# Altium project TSAL.PrjPcb
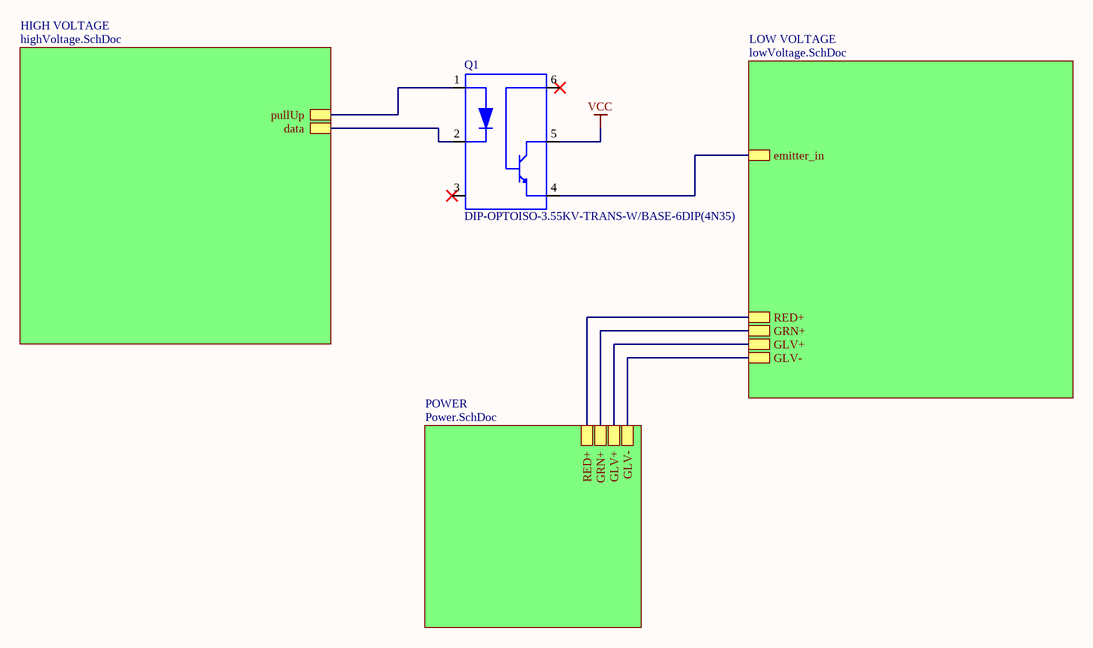
[diagram p0: TOP.SchDoc]
4 sheets, 36 parts. Net scope: hierarchical (ports join the sheet entries above them; power ports are global).
Board file: PCB.PcbDoc
Sheets:
  TOP.SchDoc
    HIGH VOLTAGE = highVoltage.SchDoc
    POWER = Power.SchDoc
    LOW VOLTAGE = lowVoltage.SchDoc

## Sheet TOP.SchDoc: =DocumentName
size A4; Organization: Queen's Formula SAE; Address1: 130 Stuart St, Kingston; Address2: Ontario; Address3: Canada; Address4: K7L 2V9; DocumentNumber: 1; Revision: 0; SheetNumber: 1; SheetTotal: 1

### Parts
Q1  DIP-OPTOISO-3.55KV-TRANS-W/BASE-6DIP(4N35)  [DIP6-2.54-7.3X6.5MM]

### Sub-sheets
HIGH VOLTAGE = highVoltage.SchDoc: pullUp, data
LOW VOLTAGE = lowVoltage.SchDoc: GLV-, GLV+, GRN+, RED+, emitter_in
POWER = Power.SchDoc: GLV-, GLV+, GRN+, RED+

### Nets
VCC: Q1.5(COLLECTOR)  [project net regulatorIn]
negativeRegulatorIn: Q1.4(EMITER) ; sheet POWER/GLV-, sheet LOW VOLTAGE/GLV-, sheet LOW VOLTAGE/emitter_in
NetD1_1: sheet POWER/GLV+, sheet LOW VOLTAGE/GLV+
NetD2_2: sheet POWER/RED+, sheet LOW VOLTAGE/RED+
NetJ1_2: sheet POWER/GRN+, sheet LOW VOLTAGE/GRN+
NetQ1_1: Q1.1(ANODE) ; sheet HIGH VOLTAGE/pullUp
NetQ1_2: Q1.2(CATHODE) ; sheet HIGH VOLTAGE/data

Not connected (* = marked no-connect by the designer): Q1 3(NC)* 6(BASE)*

### Notes on the sheet
- Title
- Size:
- Date:
- A4
- Number:
- Time:
- Revision:
- Sheet
- of
- File:

### Library data of the parts
Q1 = DIP-OPTOISO-3.55KV-TRANS-W/BASE-6DIP(4N35): Optoisolator Transistor with Base Output 5000Vrms 1 Channel 6-DIP; MF: Vishay; Purchase-URL: https://pricing.snapeda.com/search/part/4N35/?ref=eda; Price: None; SnapEDA_Link: https://www.snapeda.com/parts/4N35/Vishay%20Semiconductor%20Opto%20Division/view-part/579099/?ref=snap; MP: 4N35; Availability: Good; Value: *; Check_prices: https://www.snapeda.com/parts/4N35/Vishay%20Semiconductor%20Opto%20Division/view-part/579099/?ref=eda; Package: DIP-6 Texas Instruments

## Sheet highVoltage.SchDoc
size A4
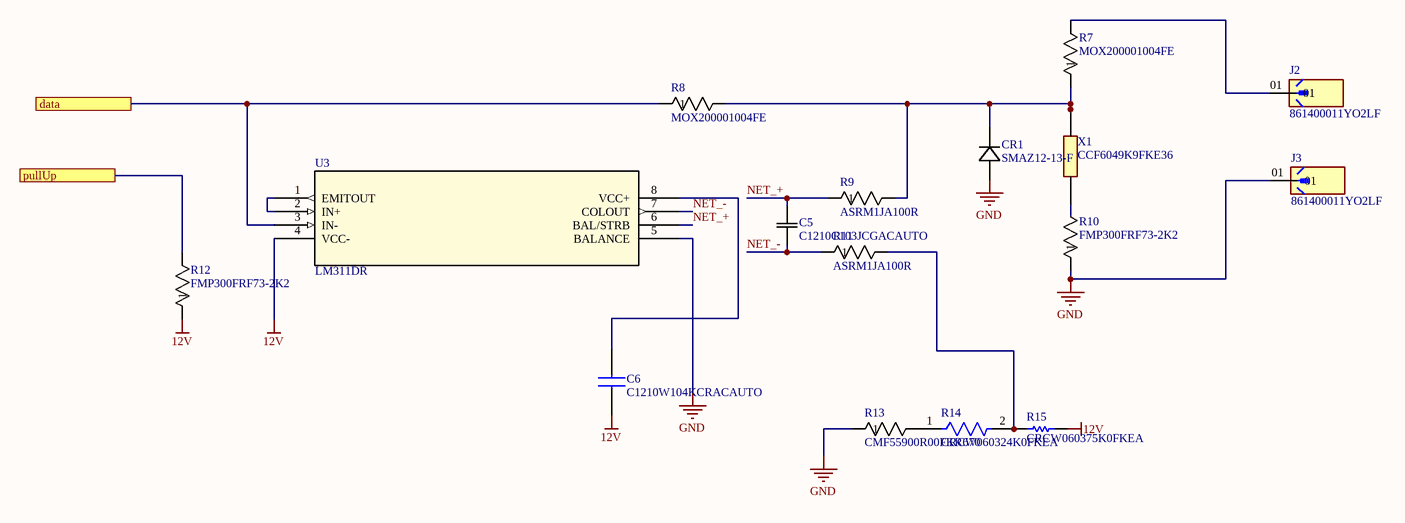
[diagram p1: highVoltage.SchDoc]

### Parts
C5  C1210C103JCGACAUTO  [CAPC340270_140N_KEM]
C6  C1210W104KCRACAUTO  [CAPC3225X230N]
CR1  SMAZ12-13-F  [SMA_DIO]
J2  861400011YO2LF  [AMPHENOL_861400011YO2LF]
J3  861400011YO2LF  [AMPHENOL_861400011YO2LF]
R7  MOX200001004FE  [RES_MOX-200_OHM]
R8  MOX200001004FE  [RES_MOX-200_OHM]
R9  ASRM1JA100R  [RES_ASRM1_STP]
R10  FMP300FRF73-2K2  [RES_FMP300_15P5X5_YAG]
R11  ASRM1JA100R  [RES_ASRM1_STP]
R12  FMP300FRF73-2K2  [RES_FMP300_15P5X5_YAG]
R13  CMF55900R00FKR670  [RES_CMF07_VIS]
R14  CRCW060324K0FKEA  [FP-CRCW0603-e3-IPC_C]
R15  CRCW060375K0FKEA  [RESC1609X50X30NL10T20]
U3  LM311DR  [D8]
X1  CCF6049K9FKE36  [RESAD2428W69L1016D353]

### Ports
data, pullUp

### Nets
12V: C6.1 R12.1 R15.2 U3.4(VCC-)
GND: J3.01 R10.1 R13.1 U3.5(BALANCE)
NET_+: C5.2 R9.1 U3.6(BAL/STRB)
NET_-: C5.1 R11.1 U3.7(COLOUT)
NetC6_2: C6.2 U3.8(VCC+)
NetCR1_1: CR1.1 R7.1 R8.2 R9.2 X1.2
NetJ2_01: J2.01 R7.2
NetQ1_1: R12.2 ; port pullUp
NetQ1_2: R8.1 U3.3(IN-) ; port data
NetR10_2: R10.2 X1.1
NetR11_2: R11.2 R14.2 R15.1
NetR13_2: R13.2 R14.1
NetU3_1: U3.1(EMITOUT) U3.2(IN+)

Not connected (* = marked no-connect by the designer): CR1 2

### Notes on the sheet
- Labels drawn without touching a wire or pin: GND

### Library data of the parts
C5 = C1210C103JCGACAUTO: No Description Available; Mfr_Name: Kemet; Type: DEV; Copyright: Copyright (C) 2024 Ultra Librarian. All rights reserved.; Manufacturer_Part_Number: C1210C103JCGACAUTO; RefDes: RefDes
C6 = C1210W104KCRACAUTO: ArcShield SMD Auto X7R HV, Ceramic, 0.1 uF, 10%, 500 VDC, 750 VDC, 125C, -55C, X7R, SMD, MLCC, ArcShield, High Voltage, Automotive Grade, 2.5 % , 1 GOhms, 105 mg, 1210, 3.3mm, 2.6mm, 2.1mm, 0.6mm, 2000, 78  Weeks, 80; Manufacturer_Name: KEMET; Geometry.Height: 2.3mm; Manufacturer_Part_Number: C1210W104KCRACAUTO; Mouser Part Number: 80-C1210W104KCRAUTO; Mouser Price/Stock: https://www.mouser.co.uk/ProductDetail/KEMET/C1210W104KCRACAUTO?qs=dO8Bi0p7p7Q4YyAQZJXbEw%3D%3D; Arrow Part Number: *; Arrow Price/Stock: *; Datasheet Link: https://content.kemet.com/datasheets/KEM_C1034_X7R_HV_ARC_SMD.pdf
CR1 = SMAZ12-13-F: No Description Available; Mfr_Name: Diodes Inc; Type: DEV; Copyright: Copyright (C) 2024 Ultra Librarian. All rights reserved.; Manufacturer_Part_Number: SMAZ12-13-F; RefDes: RefDes
J2 J3 = 861400011YO2LF: Board to Board connector, Unshrouded Header, Through Hole, Single Row, 1 Position, Vertical.; MF: AMPHENOL ICC / FCI; Purchase-URL: https://pricing.snapeda.com/search/part/861400011YO2LF/?ref=eda; Package: None; MP: 861400011YO2LF; Value: *; Digi-Key_Part_Number: 609-861400011YO2LF-ND; Check_prices: https://www.snapeda.com/parts/861400011YO2LF/Amphenol/view-part/?ref=eda; SnapEDA_Link: https://www.snapeda.com/parts/861400011YO2LF/Amphenol/view-part/?ref=snap
R7 R8 = MOX200001004FE: No Description Available; Mfr_Name: Ohmite; Copyright: Copyright (C) 2024 Ultra Librarian. All rights reserved.; Manufacturer_Part_Number: MOX200001004FE; Digi-Key_Part_Number_1: MOX200001004FE-ND; RefDes: RefDes; Type: DEV
R9 R11 = ASRM1JA100R: No Description Available; Mfr_Name: Stackpole International; Copyright: Copyright (C) 2024 Ultra Librarian. All rights reserved.; Manufacturer_Part_Number: ASRM1JA100R; RefDes: RefDes; Type: DEV
R10 R12 = FMP300FRF73-2K2: No Description Available; Mfr_Name: Yageo; Copyright: Copyright (C) 2024 Ultra Librarian. All rights reserved.; Manufacturer_Part_Number: FMP300FRF73-2K2; RefDes: RefDes; Type: DEV
R13 = CMF55900R00FKR670: No Description Available; Mfr_Name: Vishay; Copyright: Copyright (C) 2024 Ultra Librarian. All rights reserved.; Manufacturer_Part_Number: CMF55900R00FKR670; RefDes: RefDes; Type: DEV
R14 = CMP-1012-00664-3: RES Thick Film, 24kΩ, 1%, 0.1W, 100ppm/°C, 0603; Working Voltage: 75V; Resistance: 24kR; Max Power Dissipation: 100mW; Mount: Surface Mount; Depth: 0.85mm; Length: 1.55mm; Military Standard: Not; Package Quantity: 10; Tolerance: 1%; Lead Free: Lead Free; Termination: SMD/SMT; Radiation Hardening: No; Contact Plating: Tin; Temperature Coefficient: 100ppm/°C; Number of Terminations: 2; Packaging: Tape and Reel; Voltage Rating: 75V; Min Operating Temperature: -55°C; Voltage Rating (DC): 75V; Composition: Thick Film; Weight: 7.1E-05oz; Max Operating Temperature: 155°C; Case Code (Metric): 1608; Width: 0.033inch; Power Rating: 100mW; Case/Package: 0603; Height: 0.45mm; Features: Automotive AEC-Q200; Case Code (Imperial): 0603
R15 = CMP-2000-03571-1: Manufacturer: Vishay Dale; Part Number: CRCW060375K0FKEA
U3 = LM311DR: No Description Available; Mfr_Name: Texas Instruments; Copyright: Copyright (C) 2024 Ultra Librarian. All rights reserved.; Manufacturer_Part_Number: LM311DR; RefDes: RefDes; Type: DEV
X1 = CCF6049K9FKE36: Metal Film Resistors - Through Hole 1/2watt 49.9Kohms 1% Rated to 1watt; Manufacturer_Name: Vishay; Manufacturer_Part_Number: CCF6049K9FKE36; Mouser Part Number: *; Mouser Price/Stock: *; Arrow Part Number: CCF6049K9FKE36; Arrow Price/Stock: https://www.arrow.com/en/products/ccf6049k9fke36/vishay?region=nac; Datasheet Link: https://www.vishay.com/doc?31068

## Sheet Power.SchDoc
size A4
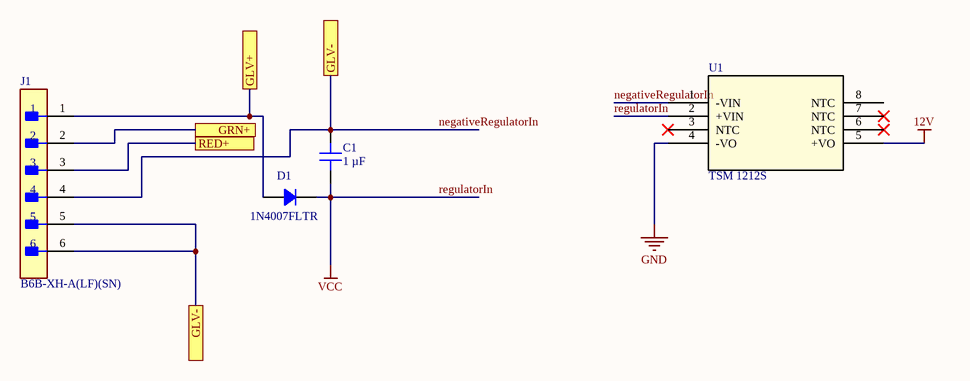
[diagram p2: Power.SchDoc]

### Parts
C1  1 µF  [CAP 0805_2012]
D1  1N4007FLTR  [SOD123F]
J1  B6B-XH-A(LF)(SN)  [FP-B6B-XH-A_LF_SN-MFG]
U1  TSM 1212S  [TSM_SINGLE_TRP]

### Ports
GLV+, GLV-, GRN+, RED+

### Nets
12V: U1.5(+VO)
GND: U1.4(-VO)
regulatorIn: C1.1 D1.2 U1.2(+VIN)  [also labelled VCC]
negativeRegulatorIn: C1.2 J1.4 J1.5 J1.6 U1.1(-VIN) ; port GLV-
NetD1_1: D1.1 J1.1 ; port GLV+
NetD2_2: J1.3 ; port RED+
NetJ1_2: J1.2 ; port GRN+

Not connected (* = marked no-connect by the designer): U1 3(NTC)* 6(NTC)* 7(NTC)* 8(NTC)

### Library data of the parts
C1 = GCJ21BR71H105KA01L: CAP CER 1UF 50V X7R 0805; manufacturer: Murata Electronics; Tolerance: ±10%; Part Number: GCJ21BR71H105KA01L; Value: 1 µF; Applications: Automotive, Boardflex Sensitive; Capacitance: 1 µF; componentlink1description: Datasheet; componentlink1url: https://www.murata.com/~/media/webrenewal/support/library/catalog/products/capacitor/mlcc/c03e.ashx?la=en-us; componentlink2description: DigiKey Link; componentlink2url: https://www.digikey.com/en/products/detail/murata-electronics/GCJ21BR71H105KA01L/4903512; Device Package: 0805 (2012 Metric); Features: Soft Termination; lastupdated: 2023-12-23 8:15:46 PM; Lifecycle Status: Active; Minimum Order: 1; Mounting Type: Surface Mount, MLCC; Operating Temperature: -55°C ~ 125°C; Package / Case: 0805 (2012 Metric); packaging: TapeAndReel; partid: 2709; Part Status: Active; price: 0.05; Ratings: AEC-Q200; series: GCJ; Size / Dimension: 0.079" L x 0.049" W (2.00mm x 1.25mm); Supplier 1: DigiKey; Supplier Part Number 1: 490-10667-1-ND; Temperature Coefficient: X7R; Thickness (Max): 0.057" (1.45mm); Voltage - Rated: 50V
D1 = 1N4007FLTR: STANDARD RECTIFIER 1000V SOD-123; Manufacturer: SMC Diode Solutions; Capacitance @ Vr, F: 15pF @ 4V, 1MHz; Current - Average Rectified (Io): 1A; Current - Reverse Leakage @ Vr: 5µA @ 1000V; Speed: Standard Recovery >500ns, > 200mA (Io); Voltage - Forward (Vf) (Max) @ If: 1.1V @ 1A; Part Number: 1N4007FLTR; ComponentLink1Description: Datasheet; ComponentLink1URL: http://www.smc-diodes.com/propdf/1N4001FL-1N4007FL%20N1646%20REV.A.pdf; ComponentLink2Description: DigiKey Link; ComponentLink2URL: http://digikey.com/product-detail/en/smc-diode-solutions/1N4007FLTR/1655-1N4007FLCT-ND/11657827; Diode Type: Standard; LastUpdated: 2020-08-30 8:59:55 PM; Lifecycle Status: Active; Minimum Order: 1; Mounting Type: Surface Mount; Package / Case: SOD-123F; Packaging: TapeAndReel; PartId: 3314; Price: 0.01; Supplier 1: DigiKey; Supplier Part Number 1: 1655-1N4007FLCT-ND; Supplier Device Package: SOD-123FL; Voltage - DC Reverse (Vr) (Max): 1000V
J1 = CMP-17439-000076-1: CONN HEADER VERT 6POS 2.5MM
U1 = TSM 1212S: No Description Available; Mfr_Name: Traco Power; Copyright: Copyright (C) 2024 Ultra Librarian. All rights reserved.; Manufacturer_Part_Number: TSM 1212S; RefDes: RefDes; Type: DEV

## Sheet lowVoltage.SchDoc
size A4
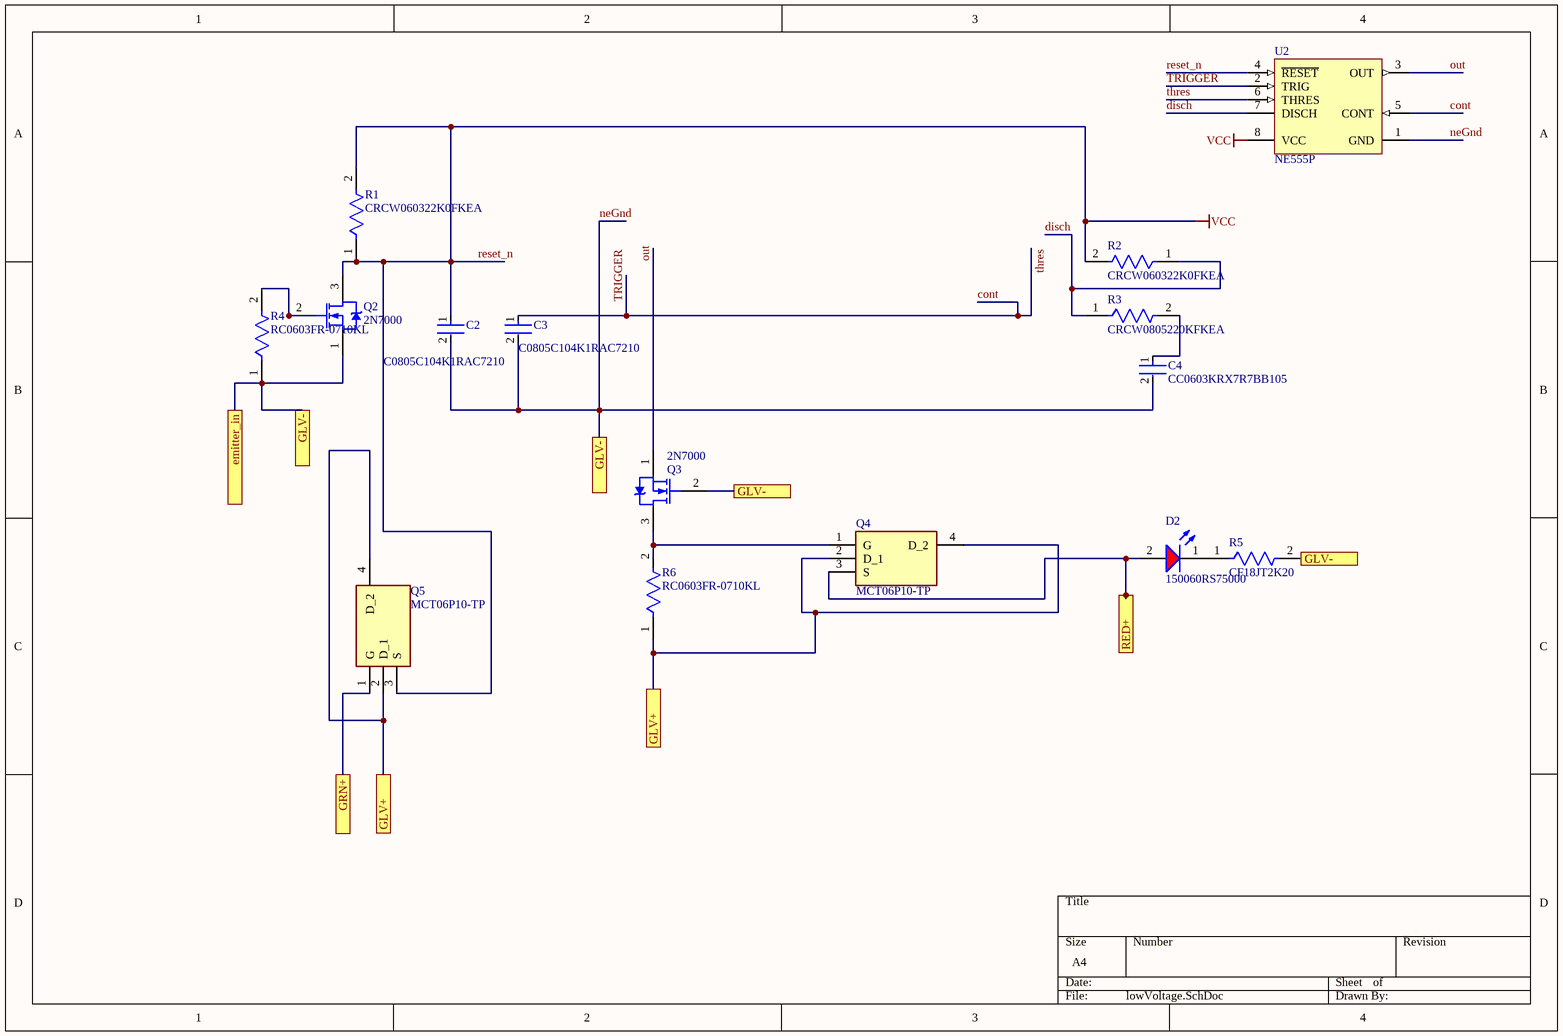
[diagram p3: lowVoltage.SchDoc]

### Parts
C2  C0805C104K1RAC7210  [FP-C0805C-DN-MFG]
C3  C0805C104K1RAC7210  [FP-C0805C-DN-MFG]
C4  CC0603KRX7R7BB105  [FP-CC0603-DA-MFG]
D2  150060RS75000  [WL-SMCW_0603_150060xx75000]
Q2  2N7000  [ONSC-TO-92-3-29-11]
Q3  2N7000  [ONSC-TO-92-3-29-11]
Q4  MCT06P10-TP  [SOT230P700X180-4N]
Q5  MCT06P10-TP  [SOT230P700X180-4N]
R1  CRCW060322K0FKEA  [FP-CRCW0603-e3-IPC_B]
R2  CRCW060322K0FKEA  [FP-CRCW0603-e3-IPC_B]
R3  CRCW0805220KFKEA  [FP-CRCW0805-e3-IPC_C]
R4  RC0603FR-0710KL  [FP-RC0603-0_55-IPC_C]
R5  CF18JT2K20  [FP-CF18-MFG]
R6  RC0603FR-0710KL  [FP-RC0603-0_55-IPC_C]
U2  NE555P  [P0008A]

### Ports
emitter_in, GLV+, GLV-, GRN+, RED+

### Nets
reset_n: C2.1 Q2.3(D) Q5.3(S) R1.1 R1.2 R2.2 U2.4(~{RESET}) U2.8(VCC)  [also labelled VCC]  [project net regulatorIn]
cont: C3.1 U2.2(TRIG) U2.5(CONT) U2.6(THRES)  [also labelled thres, TRIGGER]
disch: R2.1 R3.1 U2.7(DISCH)
neGnd: C2.2 C3.2 C4.2 Q2.1(S) Q3.2(G) R4.1 R5.2 U2.1(GND) ; port GLV-, port emitter_in  [project net negativeRegulatorIn]
out: Q3.1(S) U2.3(OUT)
NetC4_1: C4.1 R3.2
NetD1_1: Q4.2(D_1) Q4.4(D_2) Q5.2(D_1) Q5.4(D_2) R6.1 ; port GLV+
NetD2_1: D2.1(K) R5.1
NetD2_2: D2.2(A) Q4.3(S) ; port RED+
NetJ1_2: Q5.1(G) ; port GRN+
NetQ2_2: Q2.2(G) R4.2
NetQ3_3: Q3.3(D) Q4.1(G) R6.2

### Library data of the parts
C2 C3 = CMP-03020-008988-2: C0805 0.10 μF X7R 30ppm/°C 10.00% 100 V; Manufacturer: KEMET; Tolerance: 0.1; Value: 0.10 μF; Material: Ceramic; Voltage Rating: 100 V; Capacitance: 0.10 μF; RoHS: TRUE; Manufacturer Part Number: C0805C104K1RAC7210; ComponentLink2Description: Datasheet; Automotive: No; Device Class L3: Ceramic Capacitors; Category: Cap; Octopart: https://octopart.com/c0805c104k1rac7210-kemet-24791099; Temperature Range Low: -55°C; Lead Free: Yes; Device Class L2: Capacitors; ComponentLink2URL: https://content.kemet.com/datasheets/KEM_C1003_C0G_SMD.pdf; Temperature: -55°C to +125°C; Package: C0805C-DN; Temperature Range High: +125°C; Temperature Coefficient: 30ppm/°C; Ipc Land Pattern Name: CAPC200125X78; Height: 0.88mm; Device Class L1: Passive Components; Temperature Characteristic: X7R
C4 = CMP-03422-000924-1: CAP CER 1UF 16V X7R 0603; Manufacturer: YAGEO; Tolerance: 0.1; Description: CC0603 1 uF X7R 10.00% 16 V; Temperature Coefficient: 15%; Material: Ceramic; Package: CC0603-DA; RoHS: TRUE; Device Class L2: Capacitors; Temperature Characteristic: X7R; Temperature: -55°C to +125°C; Temperature Range Low: -55°C; Automotive: No; ComponentLink2Description: Datasheet; Value: 1 uF; Lead Free: Yes; Capacitance: 1 uF; ComponentLink2URL: http://www.yageo.com/documents/recent/UPY-GPHC_X7R_6.3V-to-50V_18.pdf; Device Class L1: Passive Components; Voltage: 16 V; Octopart: https://octopart.com/cc0603krx7r7bb105-yageo-42271928; Category: Cap; Digikey Description: CAP CER 1UF 16V X7R 0603; Footprint Url: http://www.yageo.com/exep/pages/download/literatures/UPY-C_GEN_24.pdf; Height: 0.9mm; Manufacturer Part Number: CC0603KRX7R7BB105; Voltage Rating: 16 V; Temperature Range High: +125°C; Mouser Description: Multilayer Ceramic Capacitor, CC Series, 1 - F, - 10%, X7R, 16 V, 0603 [1608 Metric]; Device Class L3: Ceramic Capacitors
D2 = CMP-1426-00001-3: NexarPartId: 29717776; Color: Red; Power Dissipation: 72mW; Max Reverse Voltage (DC): 5V; Peak Wavelength: 630nm; Viewing Angle: 140°; Forward Voltage: 2V; Luminous Intensity: 250mcd; Forward Current: 100mA; Dominant Wavelength: 625nm; Lens Style: Clear, Rectangular; Max Junction Temperature (Tj): 95°C; Test Current: 20mA; Mount: Surface Mount; Packaging: Tape and Reel; Case Code (Metric): 1608; Max Operating Temperature: 85°C; Case Code (Imperial): 0603; REACH SVHC: Unknown; Width: 800µm; Length: 1.6mm; Reverse Voltage: 5V; Height: 700µm; Case/Package: 0603; RoHS: Compliant; Wavelength: 625nm; Min Operating Temperature: -40°C
Q2 Q3 = CMP-1058-00936-1: Small Signal MOSFET, 200 mA, 60 V, N-Channel, 3-Pin TO-92, Bulk Box; Manufacturer: On Semiconductor; Ciss Typ (pF): 60; VGS(th) Max (V): 3; Crss Typ (pF): 5; Channel Polarity: N Channel; VGS Max (V): 20; Configuration: Single; PD Max (W): 0.35; Coss Typ (pF): 25; ID Max (A): 0.2; PackageVersion: Rev. AM; ComponentLink3URL: http://www.onsemi.cn/pub_link/Collateral/2N6426-D.PDF; ComponentLink2URL: http://www.onsemi.com/pub_link/Collateral/2N7000-D.PDF; DatasheetVersion: Rev. 8; Mounting Technology: Through Hole; V(BR)DSS Min (V): 60; PartNumber: 2N7000; PackageDescription: 3-Pin Transistor Outline, Body 4.825 x 3.685 mm, Pitch 1.27 mm; ComponentLink2Description: Datasheet; ComponentLink1URL: http://www.onsemi.com/; PackageReference: TO-92-3-29-11_AM_SL; Packing: Bulk Box; ComponentLink1Description: Manufacturer URL; Package Type: TO-92; ComponentLink3Description: Package Specification
Q4 Q5 = MCT06P10-TP: P-CHANNEL MOSFET; Manufacturer_Name: MCC; Geometry.Height: 1.8mm; Manufacturer_Part_Number: MCT06P10-TP; Mouser Part Number: 833-MCT06P10-TP; Mouser Price/Stock: https://www.mouser.co.uk/ProductDetail/Micro-Commercial-Components-MCC/MCT06P10-TP?qs=u16ybLDytRb58JP1wVwnug%3D%3D; Arrow Part Number: MCT06P10-TP; Arrow Price/Stock: https://www.arrow.com/en/products/mct06p10-tp/micro-commercial-components; Datasheet Link: https://www.mccsemi.com/pdf/Products/MCT06P10(SOT-223).pdf
R1 R2 = CMP-2000-03092-2: RES Thick Film, 22kΩ, 1%, 0.1W, 100ppm/°C, 0603; Voltage Rating: 75V; Max Power Dissipation: 100mW; Resistance: 22kR; Radiation Hardening: No; Termination: SMD/SMT; Composition: Thick Film; Tolerance: 1%; Temperature Coefficient: 100ppm/°C; Case Code (Imperial): 0603; Height: 0.45mm; Packaging: Tape and Reel; Power Rating: 100mW; Case/Package: 0603; Number of Terminations: 2; Package Quantity: 10; Weight: 7.1E-05oz; Voltage Rating (DC): 75V; Max Operating Temperature: 155°C; Contact Plating: Tin; Width: 0.85mm; Case Code (Metric): 1608; Mount: Surface Mount; Min Operating Temperature: -55°C; Depth: 0.85mm; Features: Automotive AEC-Q200; Military Standard: Not; Lead Free: Lead Free; Length: 1.55mm
R3 = CMP-1013-00772-3: RES Thick Film, 220kΩ, 1%, 0.125W, 100ppm/°C, 0805; Max Power Dissipation: 125mW; Resistance: 220kR; Voltage Rating: 150V; Max Operating Temperature: 155°C; Min Operating Temperature: -55°C; Termination: SMD/SMT; Temperature Coefficient: 100ppm/°C; Radiation Hardening: No; Number of Terminations: 2; Length: 2mm; Weight: 0.000194oz; Packaging: Tape and Reel; Case Code (Imperial): 0805; Case/Package: 0805; Military Standard: Not; Package Quantity: 10; Contact Plating: Tin; Power Rating: 125mW; Tolerance: 1%; Lead Free: Lead Free; Height: 0.45mm; Width: 1.25mm; Composition: Thick Film; Voltage Rating (DC): 150V; Features: Automotive AEC-Q200; Case Code (Metric): 2012; Depth: 1.25mm
R4 R6 = CMP-2100-03664-2: RES 10K OHM 1% 1/10W 0603; Voltage Rating: 75V; Voltage Rating (DC): 50V; Resistance: 10kR; Power Rating: 100mW; Temperature Coefficient: 100ppm/°C; Depth: 0.8mm; Termination: SMD/SMT; Resistor Type: Thick Film; Series: RC; Construction: Rectangular; Features: Moisture Resistant; Packaging: Tape and Reel; Min Operating Temperature: -55°C; Number of Terminations: 2; Lead Pitch: 0.3mm; RoHS Compliant: Yes; Case/Package: 0603; Resistance Tolerance: 1%; Military Standard: Not; Weight: 7.1E-05oz; Number of Pins: 2; Tolerance: 1%; Length: 1.6mm; Case Code (Imperial): 0603; Lead Free: Lead Free; Width: 0.8mm; Max Power Dissipation: 100mW; Height: 0.45mm; Max Operating Temperature: 155°C; Case Code (Metric): 1608; Size Code: 0603
R5 = CMP-26528-000001-1: RES 2.2K OHM 1/8W 5% CF AXIAL; Manufacturer: Stackpole Electronics Inc; Value: 2.2kΩ; Voltage Rating: 250V; Temperature Coefficient: 0/-400ppm/°C; Power Rating: 0.125W; Composition: Carbon Film; Octopart: https://octopart.com/cf18jt2k20-stackpole+electronics-19205714; Tolerance: 5%; Series: CF; Temperature Range Low: -55°C; ComponentLink2URL: https://www.seielect.com/catalog/sei-cf_cfm.pdf; Ipc Land Pattern Name: RESAD656W65L360D200; Package: CF18; Device Class L2: Resistors; Device Class L3: Through-Hole Resistors; Resistance: 2.2kΩ; Height: 2mm; Category: Res; ComponentLink2Description: Datasheet; Manufacturer Part Number: CF18JT2K20; Lead Free: Yes; Temperature Range High: +155°C; Temperature: -55°C to +155°C; RoHS: TRUE; Device Class L1: Passive Components; Digikey Description: RES 2.2K OHM 1/8W 5% CF AXIAL; Automotive: No
U2 = CMP-2000-04954-1: Precision Timer, 4.5 to 16 V, 0 to 70 degC, 8-Pin DIP, Pb-Free, Tube; Manufacturer: TexasInstruments; Maximum High Level Output Current: -200mA; Number of Internal Timers: 1; Operating Supply Voltage: 5; Maximum Low Level Output Current: 200mA; Rad Hard: No; Packaging: Rail/Tube; Manufacturer URL: http://www.ti.com/; Package Reference: P8; Package Description: 8-Pin Double In-line Package, Body 9.59 x 6.35 mm, Pitch 2.54 mm; Package URL: http://www.ti.com/lit/ml/mpdi001b/mpdi001b.pdf; Type: Standard; Datasheet URL: http://www.ti.com/general/docs/lit/getliterature.tsp?genericPartNumber=NE555&fileType=pdf; Category: Timer; Package: 8PDIP; Datasheet Version: Rev. I, 09/2014

## Nets that join several sheets
12V: highVoltage (C6.1 R12.1 R15.2 U3.4), Power (U1.5)
GND: highVoltage (J3.01 R10.1 R13.1 U3.5), Power (U1.4)
regulatorIn: TOP (Q1.5), Power (C1.1 D1.2 U1.2), lowVoltage (8 pins)
negativeRegulatorIn: TOP (Q1.4), Power (5 pins), lowVoltage (8 pins)
NetD1_1: Power (D1.1 J1.1), lowVoltage (5 pins)
NetD2_2: Power (J1.3), lowVoltage (D2.2 Q4.3)
NetJ1_2: Power (J1.2), lowVoltage (Q5.1)
NetQ1_1: TOP (Q1.1), highVoltage (R12.2)
NetQ1_2: TOP (Q1.2), highVoltage (R8.1 U3.3)